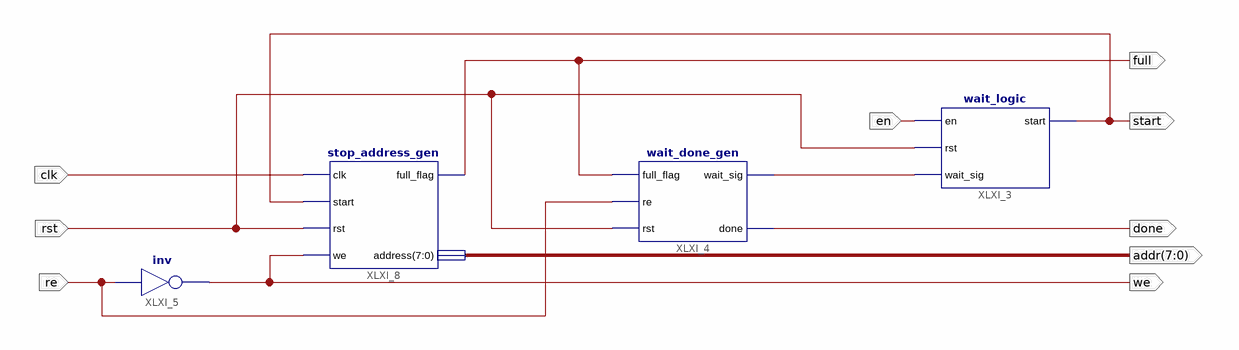
[diagram p0: schematic sheet 1]
// Xilinx ISE schematic stop_mem_control(1).sch (spartan3a) as structural Verilog: 4 symbols, 9 ports
module \stop_mem_control(1)  (
  input  en,
  input  clk,
  input  rst,
  input  re,
  output we,
  output done,
  output start,
  output full,
  output [7:0] addr
);

  wire XLXN_2;

  wait_done_gen XLXI_4 (.full_flag(full), .re(re), .rst(rst), .wait_sig(XLXN_2), .done(done));
  wait_logic XLXI_3 (.en(en), .rst(rst), .wait_sig(XLXN_2), .start(start));
  not XLXI_5 (we, re);
  stop_address_gen XLXI_8 (.clk(clk), .start(start), .rst(rst), .we(we), .full_flag(full), .address(addr));
endmodule
